# Altium schematic sheet SD Card.SchDoc: SD Card & Select Switch
size A4; DocumentNumber: 46; SheetNumber: 46; SheetTotal: 54
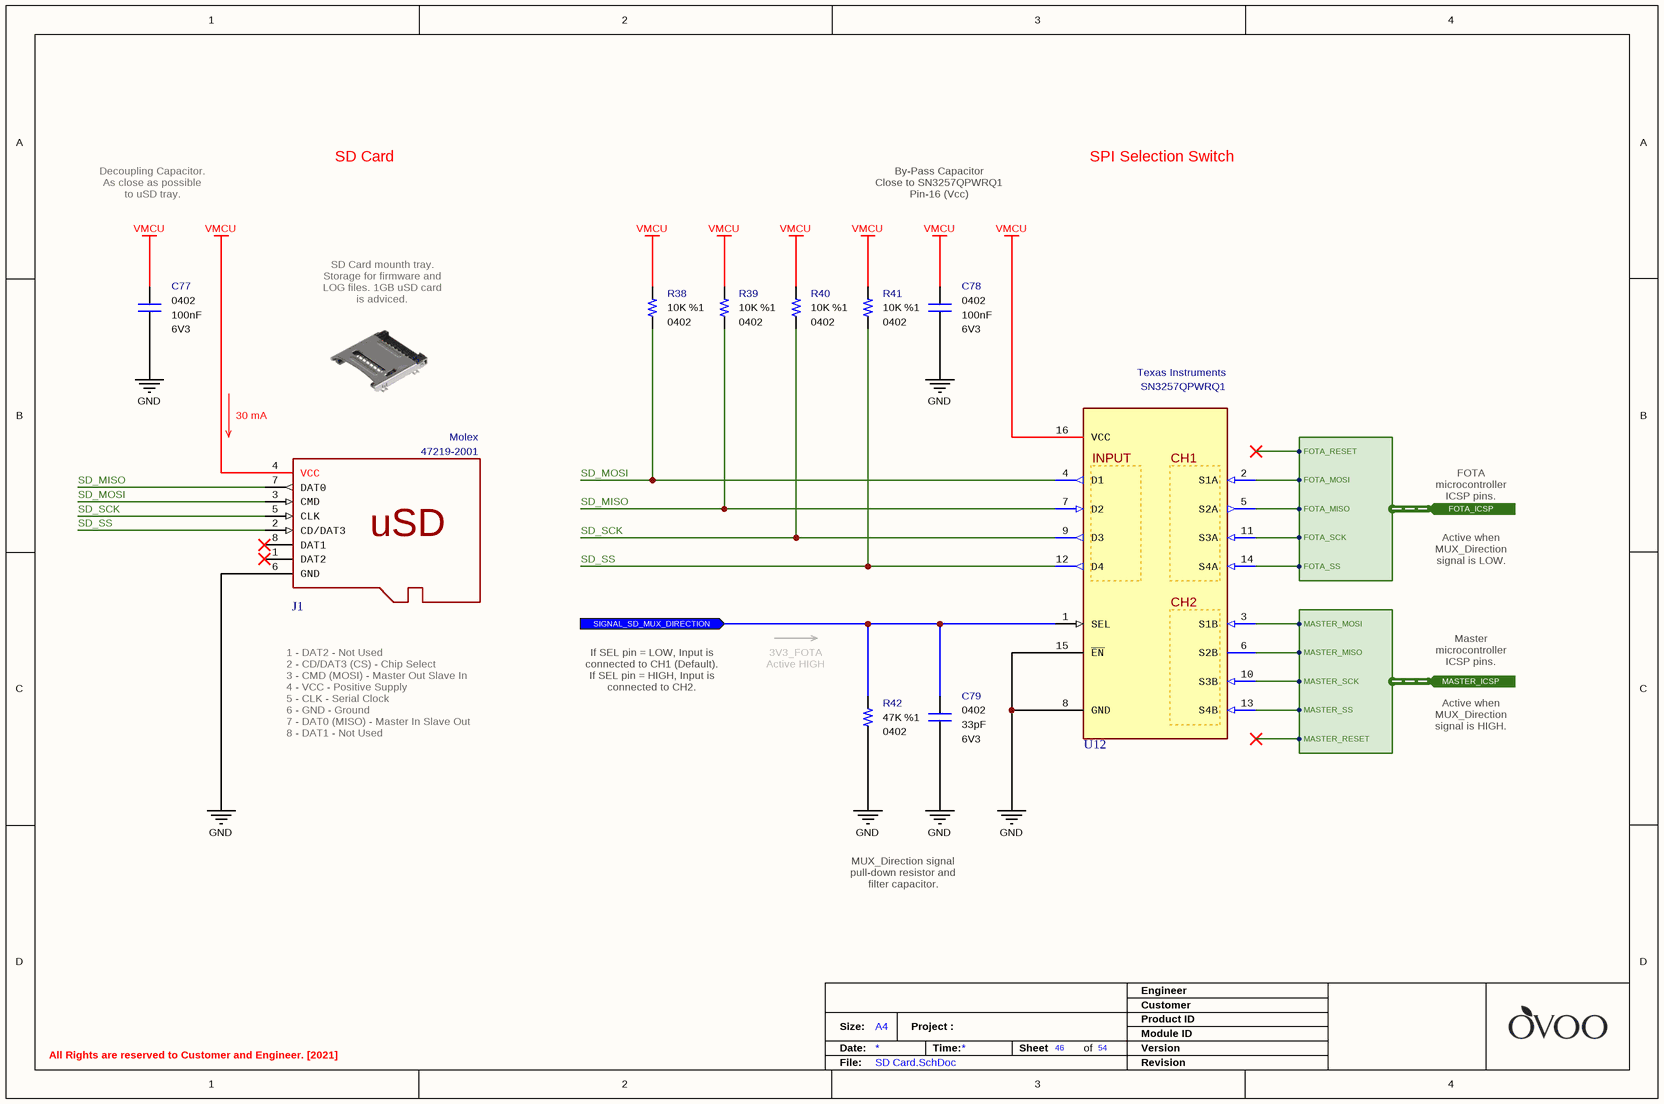
[diagram p0: SD Card.SchDoc]

## Parts
C77  value 100nF  Case: 0402  Voltage: 6V3  [CAPACITOR_0402]  (hidden comment: Multilayer Ceramic Capacitor)
C78  value 100nF  Case: 0402  Voltage: 6V3  [CAPACITOR_0402]  (hidden comment: Multilayer Ceramic Capacitor)
C79  value 33pF  Case: 0402  Voltage: 6V3  [CAPACITOR_0402]  (hidden comment: Multilayer Ceramic Capacitor)
J1  Manufacturer Part Number: 47219-2001  Manufacturer Name: Molex  [Connector - SD Module]  (hidden comment: Memory Card Connectors)
R38  value 10K  Tolerance: %1  Case: 0402  [RESISTOR_0402]  (hidden comment: Thick Film Resistor)
R39  value 10K  Tolerance: %1  Case: 0402  [RESISTOR_0402]  (hidden comment: Thick Film Resistor)
R40  value 10K  Tolerance: %1  Case: 0402  [RESISTOR_0402]  (hidden comment: Thick Film Resistor)
R41  value 10K  Tolerance: %1  Case: 0402  [RESISTOR_0402]  (hidden comment: Thick Film Resistor)
R42  value 47K  Tolerance: %1  Case: 0402  [RESISTOR_0402]  (hidden comment: Thick Film Resistor)
U12  Manufacturer Part Number: SN3257QPWRQ1  Manufacturer Name: Texas Instruments  [TSSOP-16]  (hidden comment: SPI Switch IC)

## Ports
FOTA_ICSP (in, harness FOTA_ICSP), MASTER_ICSP (in, harness MASTER_ICSP), SIGNAL_SD_MUX_DIRECTION (in)

## Harnesses
FOTA_ICSP: FOTA_RESET, FOTA_SCK, FOTA_MISO, FOTA_MOSI, FOTA_SS
MASTER_ICSP: MASTER_RESET, MASTER_SCK, MASTER_MISO, MASTER_MOSI, MASTER_SS

## Nets
GND: C77.1 C78.2 C79.1 J1.6(GND) R42.1 U12.8(GND) U12.15(~{EN})
VMCU: C77.2 C78.1 J1.4(VCC) R38.2 R39.2 R40.2 R41.2 U12.16(VCC)
SD_MISO: J1.7(DAT0) R39.1 U12.7(D2)
SD_MOSI: J1.3(CMD) R38.1 U12.4(D1)
SD_SCK: J1.5(CLK) R40.1 U12.9(D3)
SD_SS: J1.2(CD/DAT3) R41.1 U12.12(D4)
SIGNAL_SD_MUX_DIRECTION: C79.2 R42.2 U12.1(SEL) ; port SIGNAL_SD_MUX_DIRECTION
NetU12_2: U12.2(S1A) ; port FOTA_ICSP.FOTA_MOSI
NetU12_3: U12.3(S1B) ; port MASTER_ICSP.MASTER_MOSI
NetU12_5: U12.5(S2A) ; port FOTA_ICSP.FOTA_MISO
NetU12_6: U12.6(S2B) ; port MASTER_ICSP.MASTER_MISO
NetU12_10: U12.10(S3B) ; port MASTER_ICSP.MASTER_SCK
NetU12_11: U12.11(S3A) ; port FOTA_ICSP.FOTA_SCK
NetU12_13: U12.13(S4B) ; port MASTER_ICSP.MASTER_SS
NetU12_14: U12.14(S4A) ; port FOTA_ICSP.FOTA_SS

Not connected (* = marked no-connect by the designer): J1 1(DAT2)* 8(DAT1)*

## Notes on the sheet
- SD Card
- SPI Selection Switch
- Decoupling Capacitor. As close as possible to uSD tray.
- By-Pass Capacitor
  Close to SN3257QPWRQ1
  Pin-16 (Vcc)
- SD Card mounth tray. Storage for firmware and LOG files. 1GB uSD card is adviced.
- 30 mA
- FOTA microcontroller
  ICSP pins.
- Active when MUX_Direction signal is LOW.
- If SEL pin = LOW, Input is connected to CH1 (Default).
  If SEL pin = HIGH, Input is connected to CH2.
- (near R42) 3V3_FOTA
  Active HIGH
- Master microcontroller
  ICSP pins.
- 1 - DAT2 - Not Used
  2 - CD/DAT3 (CS) - Chip Select
  3 - CMD (MOSI) - Master Out Slave In
  4 - VCC - Positive Supply
  5 - CLK - Serial Clock
  6 - GND - Ground
  7 - DAT0 (MISO) - Master In Slave Out
  8 - DAT1 - Not Used
- Active when MUX_Direction signal is HIGH.
- MUX_Direction signal pull-down resistor and filter capacitor.
- Engineer
- All Rights are reserved to Customer and Engineer. [2021]
- Size:
- Date:
- A4
- Project :
- Time:
- Sheet
- of
- Customer
- Product ID
- Module ID
- Version
- File:
- Revision
- (in symbol Connector - SD Slot) uSD
- (in symbol IC - SN3257QPWRQ1) INPUT; CH1; CH2

## Library data of the parts
C77 C78 = Capacitor - 100nF [0402-6V3]: Capacitor - 100nF [0402-6V3] (Ceramic); Manufacturer Name: AVX; Manufacturer Part Number: 04026D104KAT4A; Dielectric: X5R; Tolerance: %10; Height: 0.25mm; ComponentLink1Description: Mouser; ComponentLink1URL: https://www.mouser.com.tr/ProductDetail/AVX/04026D104KAT4A?qs=sGAEpiMZZMs0AnBnWHyRQPg4iYkCw7IMED%2F4kpqgf7w%3D; ComponentLink2Description: DataSheet; ComponentLink2URL: https://www.mouser.com.tr/datasheet/2/40/cx5r-776519.pdf; ROHS: Yes; Maximum Operating Temperature: +85; Minimum Operating Temperature: -55; Supplier 1: Avnet; Supplier Part Number 1: 04026D104KAT4A; Mouser Part Number: 581-04026D104KAT4A
C79 = Capacitor - 33pF [0402-6V3]: Capacitor - 33pF [0402] (Ceramic); Manufacturer Name: Kemet; Manufacturer Part Number: C0402C330J9RACAUTO; Dielectric: X7R; Tolerance: 10%; Height: 0.5mm; Maximum Operating Temperature: +125; Minimum Operating Temperature: -55; ROHS: Yes; ComponentLink1Description: DataSheet; ComponentLink1URL: https://api.kemet.com/component-edge/download/datasheet/C0402C330J9RACAUTO.pdf; ComponentLink2Description: Mouser; ComponentLink2URL: https://www.mouser.com/Search/Refine.aspx?Keyword=80-C0402C330J9RAUTO; Supplier 1: Mouser; Supplier Part Number 1: 80-C0402C330J9RAUTO; Mouser Part Number: 80-C0402C330J9RAUTO
J1 = Connector - SD Slot: Memory Card Connectors TFR READER (HINGE TYPE); Card Type: microSD; Supplier 1: Avnet; Supplier 2: Farnell; Supplier 3: Newark; Supplier 4: Digi-Key; Supplier Part Number 2: 2614940; Supplier Part Number 1: 0472192001; Supplier Part Number 3: 32T4523; Supplier Part Number 4: WM6698CT-ND; Mouser Part Number: 538-47219-2001; Case: SMD
R38-R41 = Resistor - 10K: Thick Film Resistors - SMD 1/16 W 10 Kohms 1%; Manufacturer Name: Vishay; Manufacturer Part Number: CRCW040210K0FKED; Height: 0.4mm; ComponentLink1Description: DataSheet; ComponentLink1URL: https://www.mouser.com.tr/datasheet/2/427/dcrcwe3-1762152.pdf; ComponentLink2Description: Mouser; ComponentLink2URL: https://www.mouser.com.tr/ProductDetail/Vishay-Dale/CRCW040210K0FKED?qs=sGAEpiMZZMu61qfTUdNhG2DpbjADlD3GcalbOv9utCY%3D; Supplier 1: Mouser; Supplier 2: Digi-Key; Supplier Part Number 1: 71-CRCW040210K0FKEDH; Supplier Part Number 2: 541-10.0KYCT-ND; Mouser Part Number: 71-CRCW0402-10K-E3
R42 = Resistor - 47K: Thick Film Resistors - SMD 1/16 W 47 Kohms 1%; Manufacturer Name: Vishay; Manufacturer Part Number: CRCW040247K0FKED; Height: 0.4mm; ComponentLink1Description: DataSheet; ComponentLink1URL: https://www.mouser.com.tr/datasheet/2/427/dcrcwe3-1762152.pdf; ComponentLink2Description: Mouser; ComponentLink2URL: https://www.mouser.com.tr/ProductDetail/Vishay-Dale/CRCW040247K0FKED?qs=sGAEpiMZZMu61qfTUdNhG2DpbjADlD3GL%252B3h1elTxqU%3D; Supplier 1: Mouser; Supplier 2: Digi-Key; Supplier Part Number 1: 71-CRCW040247K0FKEDH; Supplier Part Number 2: 541-47.0KYCT-ND; Mouser Part Number: 71-CRCW0402-47K-E3
U12 = IC - SN3257QPWRQ1: Analogue Switch ICs 2:1 (SPDT), 4-channel switch with 1.8-V logic 16-TSSOP -40 to 125; Mouser Part Number: 595-SN3257QPWRQ1; ComponentLink1Description: DataSheet; ComponentLink1URL: http://www.ti.com/lit/ds/symlink/tca9546a.pdf; ComponentLink2Description: Mouser; ComponentLink2URL: https://eu.mouser.com/ProductDetail/Texas-Instruments/TCA9546APWR?qs=sGAEpiMZZMu0f%252BT2bkVfuqY85%252BzcFu6eZaMCXRqwDMg%3D; Minimum Operating Temperature: -40; Maximum Operating Temperature: +125; Supplier 1: Mouser; Supplier 2: Digi-Key; Supplier Part Number 1: 595-SN3257QPWRQ1; Supplier Part Number 2: 296-SN3257QPWRQ1CT-ND; Case: TSSOP-16